# EAGLE design 8bitPig-BaconHomev2-frontPCB (EAGLE 9.2.2)
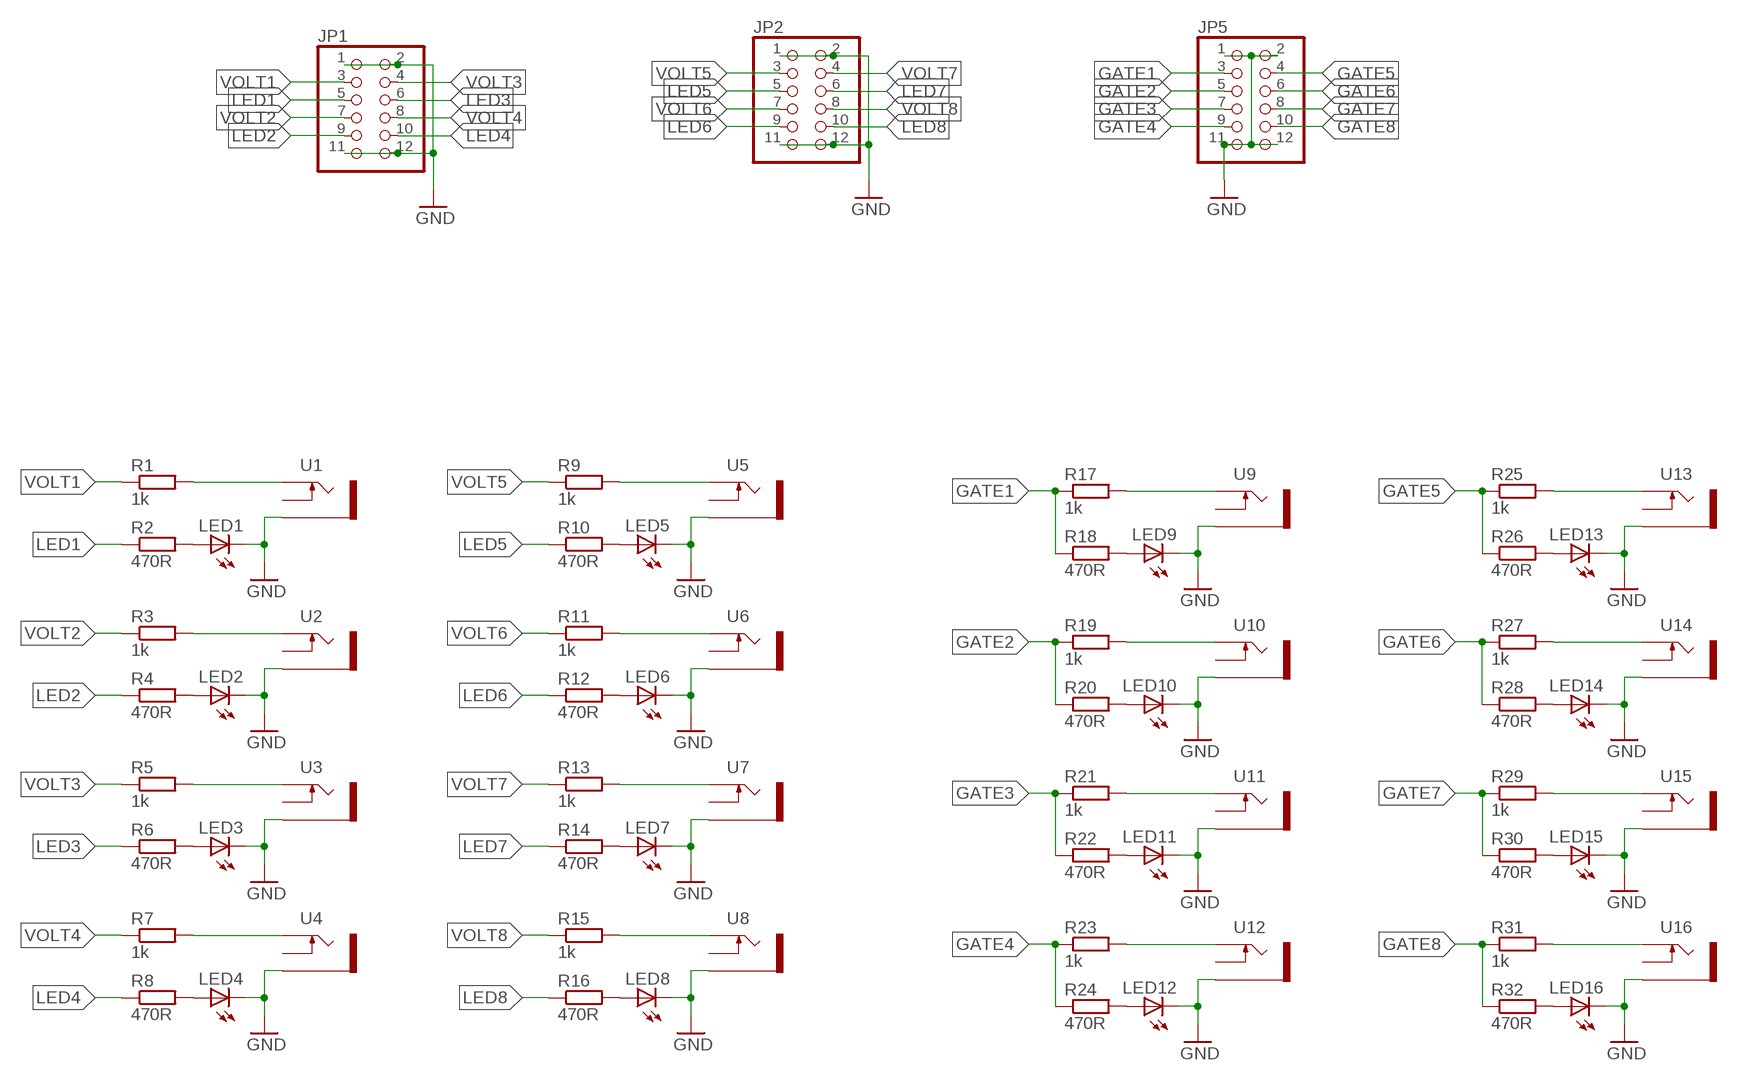
[diagram p0: schematic, sheet 1]

## Parts
JP1  PINHD-2X6  [2X06]
JP2  PINHD-2X6  [2X06]
JP5  PINHD-2X6  [2X06]
LED1  LED3MM  [LED3MM]
LED2  LED3MM  [LED3MM]
LED3  LED3MM  [LED3MM]
LED4  LED3MM  [LED3MM]
LED5  LED3MM  [LED3MM]
LED6  LED3MM  [LED3MM]
LED7  LED3MM  [LED3MM]
LED8  LED3MM  [LED3MM]
LED9  LED3MM  [LED3MM]
LED10  LED3MM  [LED3MM]
LED11  LED3MM  [LED3MM]
LED12  LED3MM  [LED3MM]
LED13  LED3MM  [LED3MM]
LED14  LED3MM  [LED3MM]
LED15  LED3MM  [LED3MM]
LED16  LED3MM  [LED3MM]
R1  1k  R-EU_R0603  [R0603]
R2  470R  R-EU_R0603  [R0603]
R3  1k  R-EU_R0603  [R0603]
R4  470R  R-EU_R0603  [R0603]
R5  1k  R-EU_R0603  [R0603]
R6  470R  R-EU_R0603  [R0603]
R7  1k  R-EU_R0603  [R0603]
R8  470R  R-EU_R0603  [R0603]
R9  1k  R-EU_R0603  [R0603]
R10  470R  R-EU_R0603  [R0603]
R11  1k  R-EU_R0603  [R0603]
R12  470R  R-EU_R0603  [R0603]
R13  1k  R-EU_R0603  [R0603]
R14  470R  R-EU_R0603  [R0603]
R15  1k  R-EU_R0603  [R0603]
R16  470R  R-EU_R0603  [R0603]
R17  1k  R-EU_R0603  [R0603]
R18  470R  R-EU_R0603  [R0603]
R19  1k  R-EU_R0603  [R0603]
R20  470R  R-EU_R0603  [R0603]
R21  1k  R-EU_R0603  [R0603]
R22  470R  R-EU_R0603  [R0603]
R23  1k  R-EU_R0603  [R0603]
R24  470R  R-EU_R0603  [R0603]
R25  1k  R-EU_R0603  [R0603]
R26  470R  R-EU_R0603  [R0603]
R27  1k  R-EU_R0603  [R0603]
R28  470R  R-EU_R0603  [R0603]
R29  1k  R-EU_R0603  [R0603]
R30  470R  R-EU_R0603  [R0603]
R31  1k  R-EU_R0603  [R0603]
R32  470R  R-EU_R0603  [R0603]
U1  THONKICONNNEW  [WQP-PJ301M-12_JACK]
U2  THONKICONNNEW  [WQP-PJ301M-12_JACK]
U3  THONKICONNNEW  [WQP-PJ301M-12_JACK]
U4  THONKICONNNEW  [WQP-PJ301M-12_JACK]
U5  THONKICONNNEW  [WQP-PJ301M-12_JACK]
U6  THONKICONNNEW  [WQP-PJ301M-12_JACK]
U7  THONKICONNNEW  [WQP-PJ301M-12_JACK]
U8  THONKICONNNEW  [WQP-PJ301M-12_JACK]
U9  THONKICONNNEW  [WQP-PJ301M-12_JACK]
U10  THONKICONNNEW  [WQP-PJ301M-12_JACK]
U11  THONKICONNNEW  [WQP-PJ301M-12_JACK]
U12  THONKICONNNEW  [WQP-PJ301M-12_JACK]
U13  THONKICONNNEW  [WQP-PJ301M-12_JACK]
U14  THONKICONNNEW  [WQP-PJ301M-12_JACK]
U15  THONKICONNNEW  [WQP-PJ301M-12_JACK]
U16  THONKICONNNEW  [WQP-PJ301M-12_JACK]

## Nets
GATE1: JP5.3 R17.1 R18.1
GATE2: JP5.5 R19.1 R20.1
GATE3: JP5.7 R21.1 R22.1
GATE4: JP5.9 R23.1 R24.1
GATE5: JP5.4 R25.1 R26.1
GATE6: JP5.6 R27.1 R28.1
GATE7: JP5.8 R29.1 R30.1
GATE8: JP5.10 R31.1 R32.1
GND [pwr]: JP1.1 JP1.2 JP1.11 JP1.12 JP2.1 JP2.2 JP2.11 JP2.12 JP5.1 JP5.2 JP5.11 JP5.12 LED1.K(C) LED2.K(C) LED3.K(C) LED4.K(C) LED5.K(C) LED6.K(C) LED7.K(C) LED8.K(C) LED9.K(C) LED10.K(C) LED11.K(C) LED12.K(C) LED13.K(C) LED14.K(C) LED15.K(C) LED16.K(C) U1.P$3_SLEEVE(SLEEVE) U2.P$3_SLEEVE(SLEEVE) U3.P$3_SLEEVE(SLEEVE) U4.P$3_SLEEVE(SLEEVE) U5.P$3_SLEEVE(SLEEVE) U6.P$3_SLEEVE(SLEEVE) U7.P$3_SLEEVE(SLEEVE) U8.P$3_SLEEVE(SLEEVE) U9.P$3_SLEEVE(SLEEVE) U10.P$3_SLEEVE(SLEEVE) U11.P$3_SLEEVE(SLEEVE) U12.P$3_SLEEVE(SLEEVE) U13.P$3_SLEEVE(SLEEVE) U14.P$3_SLEEVE(SLEEVE) U15.P$3_SLEEVE(SLEEVE) U16.P$3_SLEEVE(SLEEVE)
LED1: JP1.5 R2.1
LED2: JP1.9 R4.1
LED3: JP1.6 R6.1
LED4: JP1.10 R8.1
LED5: JP2.5 R10.1
LED6: JP2.9 R12.1
LED7: JP2.6 R14.1
LED8: JP2.10 R16.1
N$1: LED1.A R2.2
N$2: R1.2 U1.P$1_TIP(TIP)
N$3: LED2.A R4.2
N$4: R3.2 U2.P$1_TIP(TIP)
N$5: LED3.A R6.2
N$6: R5.2 U3.P$1_TIP(TIP)
N$7: LED4.A R8.2
N$8: R7.2 U4.P$1_TIP(TIP)
N$9: LED5.A R10.2
N$10: R9.2 U5.P$1_TIP(TIP)
N$11: LED6.A R12.2
N$12: R11.2 U6.P$1_TIP(TIP)
N$13: LED7.A R14.2
N$14: R13.2 U7.P$1_TIP(TIP)
N$15: LED8.A R16.2
N$16: R15.2 U8.P$1_TIP(TIP)
N$17: LED9.A R18.2
N$18: R17.2 U9.P$1_TIP(TIP)
N$19: LED10.A R20.2
N$20: R19.2 U10.P$1_TIP(TIP)
N$21: LED11.A R22.2
N$22: R21.2 U11.P$1_TIP(TIP)
N$23: LED12.A R24.2
N$24: R23.2 U12.P$1_TIP(TIP)
N$25: LED13.A R26.2
N$26: R25.2 U13.P$1_TIP(TIP)
N$27: LED14.A R28.2
N$28: R27.2 U14.P$1_TIP(TIP)
N$29: LED15.A R30.2
N$30: R29.2 U15.P$1_TIP(TIP)
N$33: LED16.A R32.2
N$34: R31.2 U16.P$1_TIP(TIP)
VOLT1: JP1.3 R1.1
VOLT2: JP1.7 R3.1
VOLT3: JP1.4 R5.1
VOLT4: JP1.8 R7.1
VOLT5: JP2.3 R9.1
VOLT6: JP2.7 R11.1
VOLT7: JP2.4 R13.1
VOLT8: JP2.8 R15.1
Unconnected: U1.P$2_SWITCH(SWITCH) U2.P$2_SWITCH(SWITCH) U3.P$2_SWITCH(SWITCH) U4.P$2_SWITCH(SWITCH) U5.P$2_SWITCH(SWITCH) U6.P$2_SWITCH(SWITCH) U7.P$2_SWITCH(SWITCH) U8.P$2_SWITCH(SWITCH) U9.P$2_SWITCH(SWITCH) U10.P$2_SWITCH(SWITCH) U11.P$2_SWITCH(SWITCH) U12.P$2_SWITCH(SWITCH) U13.P$2_SWITCH(SWITCH) U14.P$2_SWITCH(SWITCH) U15.P$2_SWITCH(SWITCH) U16.P$2_SWITCH(SWITCH)

## Library data of the parts
JP1 JP2 JP5 = pinhead:PINHD-2X6: PIN HEADER
LED1-LED16 = led:LED: LED OSRAM: - CHIPLED LG R971, LG N971, LY N971, LG Q971, LY Q971, LO R971, LY R971 LH N974, LH R974 LS Q976, LO Q976, LY Q976 LO Q996 - Hyper CHIPLED LW Q18S LB Q993, LB Q99A, LB R99A - SideLED LS A670, LO A670, LY A670, LG A670, LP A670 LB A673, LV A673, LT A673, LW A673 LH A674 LY A675 LS A676, LA A676, LO A676, LY A676, LW A676 LS A679, LY A679, LG A679 - Hyper Micro SIDELED® LS Y876, LA Y876, LO Y876, LY Y876 LT Y87S - SmartLED LW L88C, LW L88S LB L89C, LB L89S, LG L890 LS L89K, LO L89K, LY L89K LS L896, LA L896, LO L896, LY L896 - TOPLED LS T670, LO T670, LY T670, LG T670, LP T670 LSG T670, LSP T670, LSY T670, LOP T670, LYG T670 LG T671, LOG T671, LSG T671 LB T673, LV T673, LT T673, LW T673 LH T674 LS T676, LA T676, LO T676, LY T676, LB T676, LH T676, LSB T676, LW T676 LB T67C, LV T67C, LT T67C, LS T67K, LO T67K, LY T67K, LW E67C LS E67B, LA E67B, LO E67B, LY E67B, LB E67C, LV E67C, LT E67C LW T67C LS T679, LY T679, LG T679 LS T770, LO T770, LY T770, LG T770, LP T770 LB T773, LV T773, LT T773, LW T773 LH T774 LS E675, LA E675, LY E675, LS T675 LS T776, LA T776, LO T776, LY T776, LB T776 LHGB T686 LT T68C, LB T68C - Hyper Mini TOPLED® LB M676 - Mini TOPLED Santana® LG M470 LS M47K, LO M47K, LY M47K Source: http://www.osram.convergy.de LUXEON: - LUMILED® LXK2-PW12-R00, LXK2-PW12-S00, LXK2-PW14-U00, LXK2-PW14-V00 LXK2-PM12-R00, LXK2-PM12-S00, LXK2-PM14-U00 LXK2-PE12-Q00, LXK2-PE12-R00, LXK2-PE12-S00, LXK2-PE14-T00, LXK2-PE14-U00 LXK2-PB12-K00, LXK2-PB12-L00, LXK2-PB12-M00, LXK2-PB14-N00, LXK2-PB14-P00, LXK2-PB14-Q00 LXK2-PR12-L00, LXK2-PR12-M00, LXK2-PR14-Q00, LXK2-PR14-R00 LXK2-PD12-Q00, LXK2-PD12-R00, LXK2-PD12-S00 LXK2-PH12-R00, LXK2-PH12-S00 LXK2-PL12-P00, LXK2-PL12-Q00, LXK2-PL12-R00 Source: www.luxeon.com KINGBRIGHT: KA-3528ASYC Source: www.kingbright.com
R1-R32 = resistor:R-EU_: RESISTOR, European symbol
U1-U16 = MusicThingModular:THONKICONN: 3.5mm socket for Eurorack modular synths

## Net classes
0 default: width 0.152 mm, clearance 0.508 mm
1 pwr: width 0.254 mm, clearance 0.508 mm
2 spi: width 0.152 mm, clearance 0.508 mm

## Board
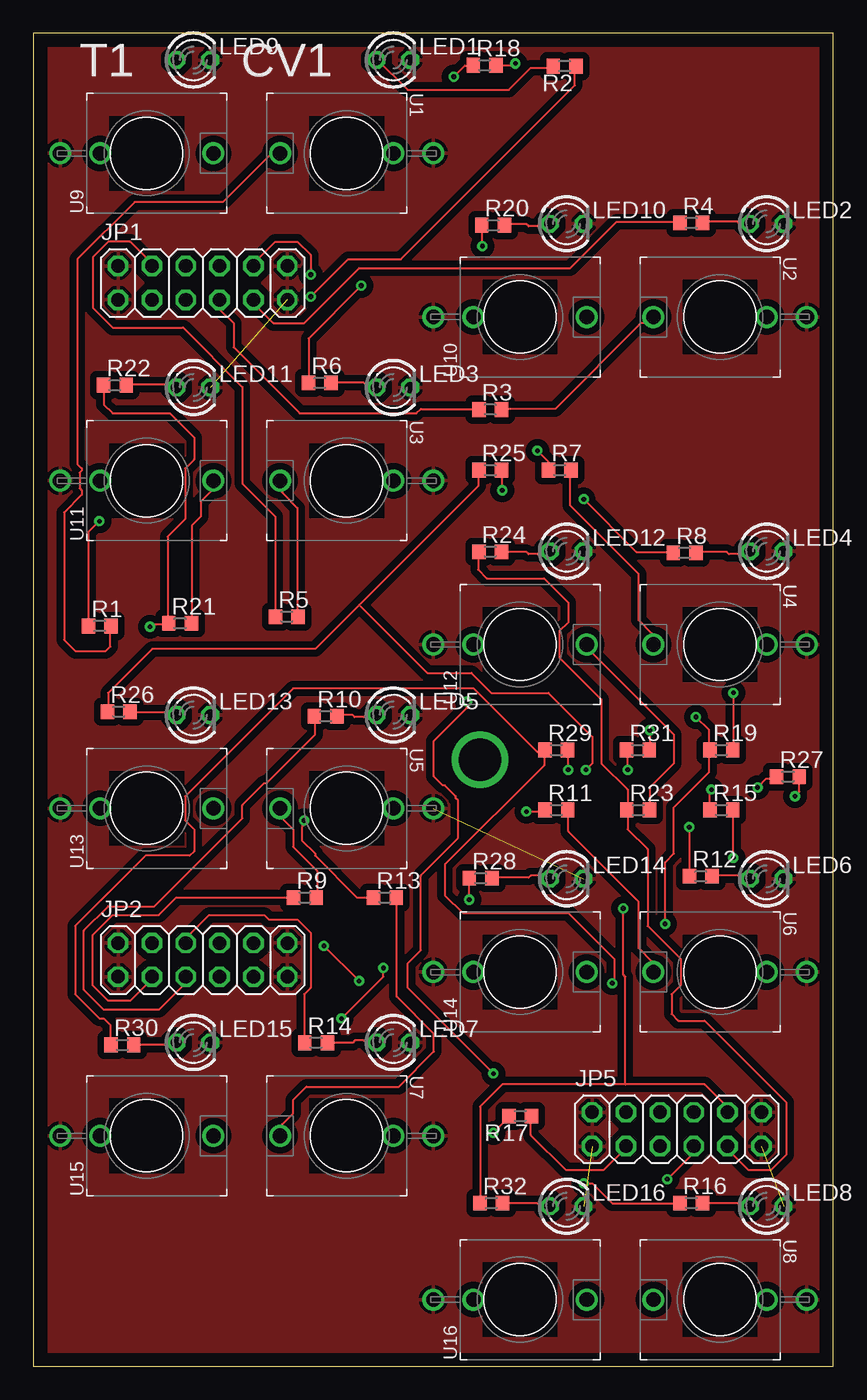
[diagram p1: board, top side]
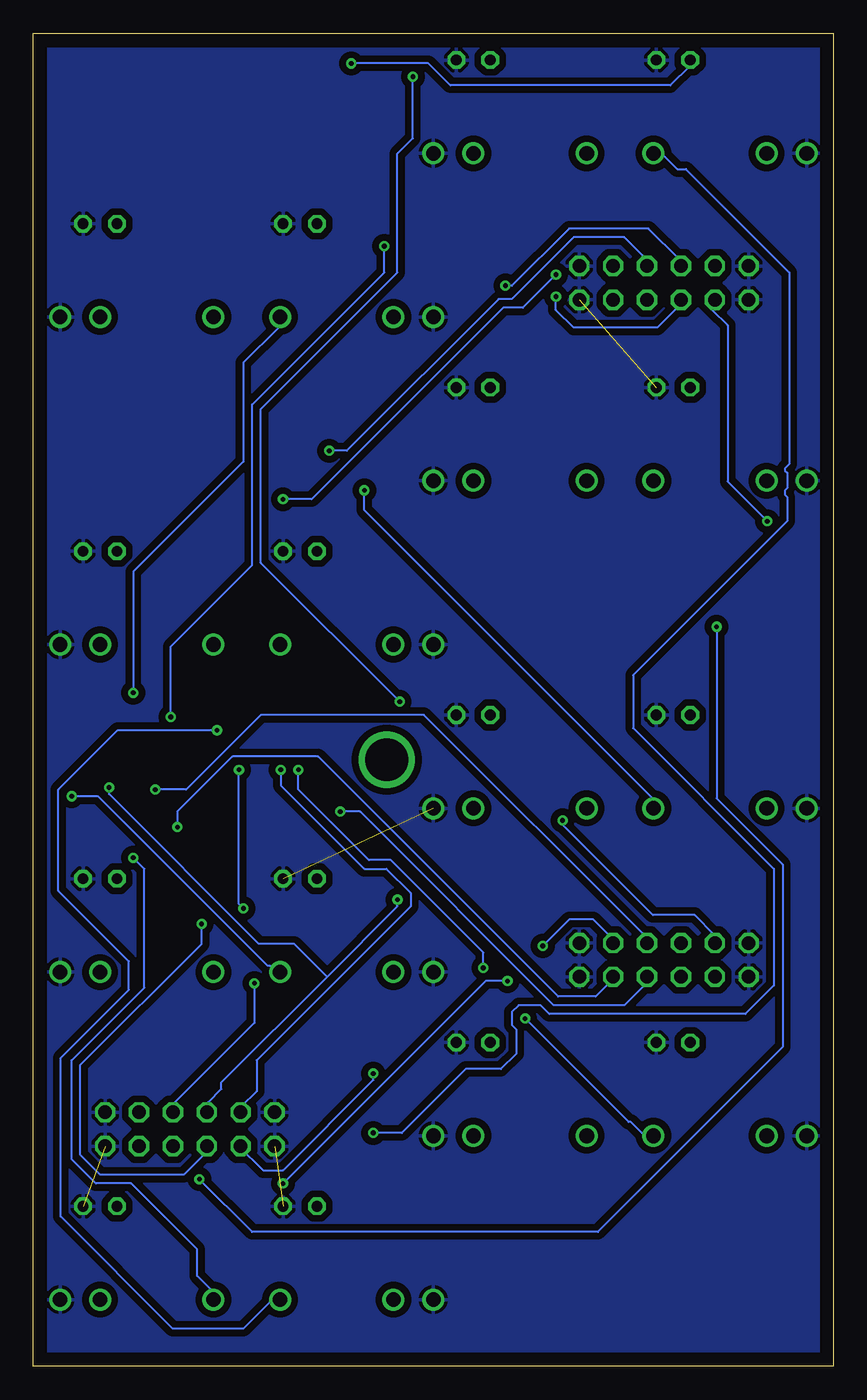
[diagram p2: board, bottom side, seen from below]

Size 60 x 100 mm. Coordinates in mm from the lower left corner, seen from the top.
Outline: 0,0 60,0 60,100 0,100 0,0
Copper layers (1*16): Top 0.035mm / dielectric 1.5mm / Bottom 0.035mm
Design rules "default": minimum track width 6mil, minimum drill 0.35mm, track to track 6mil, track to pad 6mil, pad to pad 6mil, via to via 6mil, smd to smd 6mil, copper to edge 40mil, drill to drill 6mil, minimum pad ring 10mil, minimum via ring 8mil, stop-mask expansion 4mil, vias tented up to drill 0mil, thermal gap 10mil

### Footprints (pad centres in the part's own frame; a part is rotated, then mirrored left to right if it is on the bottom)
2X06 = drill 1.016 octagon: 1 -6.35,-1.27; 2 -6.35,1.27; 3 -3.81,-1.27; 4 -3.81,1.27; 5 -1.27,-1.27; 6 -1.27,1.27; 7 1.27,-1.27; 8 1.27,1.27; 9 3.81,-1.27; 10 3.81,1.27; 11 6.35,-1.27; 12 6.35,1.27
LED3MM = drill 0.813 octagon: A -1.27,0; K 1.27,0
R0603 = smd 1 x 1.1: 1 -0.85,0; 2 0.85,0
WQP-PJ301M-12_JACK = drill 1.1: P$1_TIP 0,5; P$2_SWITCH 0,-3.5; P$3_SLEEVE 0,-6.5

### Placement (x,y rotation side)
JP1  12.7,81.28 0 top
JP2  12.7,30.48 0 top
JP5  48.26,17.78 0 top
LED1  27,98 0 top
LED2  55,85.71 0 top
LED3  27,73.43 0 top
LED4  55,61.14 0 top
LED5  27,48.86 0 top
LED6  55,36.57 0 top
LED7  27,24.29 0 top
LED8  55,12 0 top
LED9  12,98 0 top
LED10  40,85.71 0 top
LED11  12,73.43 0 top
LED12  40,61.14 0 top
LED13  12,48.86 0 top
LED14  40,36.57 0 top
LED15  12,24.29 0 top
LED16  40,12 0 top
R1  4.99,55.53 0 top
R2  39.85,97.53 180 top
R3  34.26,71.77 0 top
R4  49.35,85.77 0 top
R5  19,56.23 0 top
R6  21.49,73.77 0 top
R7  39.49,67.23 0 top
R8  48.85,61.02 0 top
R9  20.36,35.15 0 top
R10  21.92,48.76 0 top
R11  39.23,41.73 0 top
R12  50.06,36.76 0 top
R13  26.36,35.15 0 top
R14  21.2,24.26 0 top
R15  51.61,41.73 0 top
R16  49.35,12.24 0 top
R17  36.51,18.77 180 top
R18  33.85,97.6 0 top
R19  51.61,46.23 0 top
R20  34.49,85.6 0 top
R21  11,55.73 0 top
R22  6.12,73.6 0 top
R23  45.35,41.73 0 top
R24  34.26,61.1 0 top
R25  34.26,67.23 0 top
R26  6.4,49.1 0 top
R27  56.6,44.23 0 top
R28  33.54,36.6 0 top
R29  39.22,46.23 0 top
R30  6.68,24.1 0 top
R31  45.35,46.23 0 top
R32  34.35,12.23 0 top
U1  23.5,91 90 top
U2  51.5,78.71 90 top
U3  23.5,66.43 90 top
U4  51.5,54.14 90 top
U5  23.5,41.86 90 top
U6  51.5,29.57 90 top
U7  23.5,17.29 90 top
U8  51.5,5 90 top
U9  8.5,91 270 top
U10  36.5,78.71 270 top
U11  8.5,66.43 270 top
U12  36.5,54.14 270 top
U13  8.5,41.86 270 top
U14  36.5,29.57 270 top
U15  8.5,17.29 270 top
U16  36.5,5 270 top

### Tracks (layer width: path | path; a pad name or v marks a point on that pad's centre or on a via)
GATE1  (via drill 0.35)
  Top 0.152: R17.1 37.31,18.66 37.31,17.34 39.95,14.69 42.76,14.69 44.58,16.51 JP5.3 | v31.53,96.75 32.36,97.57 32.85,97.57 R18.1 | v32.52,49.86 32.52,49.37 30.05,46.89 30.05,44.25 30.71,43.59 30.87,43.59 31.7,42.76 31.7,42.6 31.86,42.43 31.86,39.62 29.06,36.82 29.06,31.2 28.07,30.21 28.07,28.4 v34.51,21.96
  Bottom 0.152: v31.53,96.75 31.53,92.13 32.69,90.97 32.69,82.06 42.93,71.82 42.93,60.26 v32.52,49.86 | v34.51,21.96 34.51,21.46 41.27,14.69 42.76,14.69 44.58,16.51 JP5.3
GATE2  (via drill 0.35)
  Top 0.152: v47.38,33.19 47.38,37.81 48.04,38.47 48.04,41.94 50.69,44.58 50.69,46.06 R19.1 50.69,46.23 50.69,47.71 v49.7,48.7 | v33.68,84.04 33.68,85.52 R20.1
  Bottom 0.152: v47.38,33.19 47.38,31.7 56.46,22.62 56.46,15.85 54.98,14.36 48.7,14.36 47.05,16.02 47.05,16.51 JP5.5 | v33.68,84.04 33.68,82.06 43.59,72.15 43.59,60.1 49.7,53.99 v49.7,48.7
GATE3  (via drill 0.35)
  Top 0.152: R22.1 5.28,73.47 5.28,72.15 5.94,71.49 10.24,71.49 12.05,69.67 12.05,68.02 11.39,67.36 11.39,63.56 10.07,62.24 10.07,55.8 R21.1 10.07,55.64 8.91,55.64 v8.75,55.47 | JP5.7 49.53,16.02 v47.55,14.03
  Bottom 0.152: v47.55,14.03 43.59,10.07 17.67,10.07 3.8,23.94 3.8,37.64 8.75,42.6 v8.75,55.47
GATE4
  Top 0.152: R24.1 33.35,61.09 33.35,59.77 34.01,59.11 38.3,59.11 40.12,57.29 40.12,55.8 39.46,55.14 39.46,53.16 42.6,50.02 42.6,45.24 44.58,43.26 44.58,41.77 R23.1 44.58,41.6 44.58,40.28 46.06,38.8 46.06,33.02 48.54,30.54 48.54,28.56 47.88,27.9 47.88,26.42 48.37,25.92 50.35,25.92 56.46,19.81 56.46,15.85 55.31,14.69 53.66,14.69 52.17,16.18 52.17,16.51 JP5.9
GATE5  (via drill 0.35)
  Top 0.152: 24.43,57.12 33.35,66.04 33.35,67.2 R25.1 | 24.43,57.12 21.13,53.82 8.91,53.82 5.61,50.52 5.61,49.2 R26.1 | v41.44,44.74 41.94,45.24 41.94,47.22 38.63,50.52 34.34,50.52 32.85,52.01 29.55,52.01 24.43,57.12
  Bottom 0.152: v41.44,44.74 41.44,43.59 35.17,37.31 33.52,37.31 31.7,35.5 31.7,34.51 43.26,22.95 43.26,20.64 44.41,19.48 44.41,19.15 JP5.4
GATE6  (via drill 0.35)
  Top 0.152: v32.69,35 32.69,36.49 R28.1 | v54.32,43.42 54.98,44.08 55.64,44.08 R27.1
  Bottom 0.152: v32.69,35 32.69,34.51 37.97,29.22 | 37.97,29.22 45.9,21.3 45.9,20.8 46.89,19.81 46.89,19.15 JP5.6 | v54.32,43.42 54.32,42.93 43.09,31.7 40.45,31.7 37.97,29.22
GATE7  (via drill 0.35)
  Top 0.152: 38.3,46.06 37.81,46.06 33.02,50.85 19.48,50.85 11.39,42.76 11.39,40.95 12.05,40.28 12.05,38.63 11.72,38.3 8.42,38.3 3.14,33.02 3.14,27.9 4.95,26.09 5.28,26.09 5.78,25.59 5.78,24.11 R30.1 | v43.42,28.73 43.59,28.89 43.59,30.54 40.12,34.01 32.19,34.01 30.87,35.33 30.87,37.64 38.3,45.07 38.3,46.06 | 38.3,46.06 R29.1
  Bottom 0.152: JP5.8 49.53,19.65 43.42,25.76 v43.42,28.73
GATE8  (via drill 0.35)
  Top 0.152: 44.41,21.13 50.35,21.13 52.01,19.48 52.01,19.15 JP5.10 | 44.41,21.13 35.17,21.13 33.52,19.48 33.52,12.38 R32.1 | v44.58,44.74 44.58,46.06 R31.1 | v44.25,34.34 44.25,29.39 44.41,29.22 44.41,21.13
  Bottom 0.152: v44.58,44.74 44.58,34.67 v44.25,34.34
GND  (4 unrouted)
  pour Top: 1,99 58.5,99 59,99 59,1 1,1
  pour Bottom: 1,99 59,99 59,1 1,1
LED1  (via drill 0.35)
  Top 0.152: v20.8,80.24 23.61,83.05 27.57,83.05 40.62,96.09 40.62,97.41 R2.1
  Bottom 0.152: v20.8,80.24 20.8,79.25 19.48,77.93 13.21,77.93 11.56,79.58 11.56,79.91 JP1.5
LED2
  Top 0.152: JP1.9 16.51,79.74 18,78.26 20.31,78.26 24.43,82.39 40.28,82.39 43.75,85.85 48.37,85.85 R4.1
LED3  (via drill 0.35)
  Top 0.152: v24.6,81.06 20.64,77.1 20.64,73.8 R6.1
  Bottom 0.152: v24.6,81.06 24.11,81.06 19.81,85.36 13.87,85.36 11.56,83.05 11.56,82.55 JP1.6
LED4  (via drill 0.35)
  Top 0.152: v41.27,65.05 45.24,61.09 47.88,61.09 R8.1 | v20.8,81.89 20.8,83.38 19.81,84.37 18.16,84.37 16.51,82.72 JP1.10
  Bottom 0.152: v41.27,65.05 39.13,65.05 24.77,79.41 23.28,79.41 v20.8,81.89
LED5
  Top 0.152: R10.1 21.13,48.7 21.13,47.38 17.5,43.75 17.34,43.75 15.68,42.1 15.68,41.11 9.08,34.51 5.61,34.51 3.8,32.69 3.8,28.23 5.28,26.75 9.41,26.75 11.39,28.73 11.39,29.06 JP2.5
LED6  (via drill 0.35)
  Top 0.152: v49.2,40.45 49.2,36.82 R12.1
  Bottom 0.152: v49.2,40.45 49.2,41.6 45.07,45.73 38.63,45.73 20.64,27.74 17.83,27.74 16.51,29.06 JP2.9
LED7
  Top 0.152: R14.1 20.31,24.27 20.31,27.9 20.8,28.4 20.8,32.52 19.81,33.52 17.67,33.52 17.34,33.85 13.21,33.85 11.56,32.19 11.56,31.86 JP2.6
LED8  (via drill 0.35)
  Top 0.152: v41.27,13.7 41.94,13.7 43.42,12.22 48.37,12.22 R16.1 | v21.79,31.53 v24.43,28.89
  Bottom 0.152: v41.27,13.7 26.09,28.89 v24.43,28.89 | v21.79,31.53 19.81,33.52 18,33.52 16.51,32.03 JP2.10
N0$31  (via drill 3.2)
  other vias: 33.5,45.5
N$1
  Top 0.152: R2.2 38.96,97.41 37.31,97.41 35.66,95.76 28.07,95.76 25.76,98.07 LED1.A
N$2
  Top 0.152: R1.2 5.78,55.47 5.78,53.99 5.45,53.66 3.14,53.66 2.31,54.48 2.31,64.06 3.63,65.38 3.63,65.71 3.47,65.88 3.47,67.03 3.63,67.2 3.63,67.36 3.3,67.69 3.3,83.05 7.59,87.34 14.2,87.34 17.83,90.97 18.49,90.97 U1.P$1_TIP
N$3
  Top 0.152: R4.2 50.35,85.85 52.83,85.85 53,85.69 53.66,85.69 LED2.A
N$4
  Top 0.152: R3.2 35.17,71.82 39.13,71.82 45.57,78.26 45.73,78.26 46.06,78.59 46.39,78.59 U2.P$1_TIP
N$5
  Top 0.152: R6.2 22.45,73.8 24.77,73.8 25.09,73.47 25.59,73.47 LED3.A
N$6
  Top 0.152: R5.2 19.81,56.3 19.81,64.39 18.66,65.55 18.66,66.37 U3.P$1_TIP
N$7
  Top 0.152: R8.2 49.86,61.09 52.01,61.09 52.17,60.92 52.83,60.92 53,61.09 53.66,61.09 LED4.A
N$8
  Top 0.152: R7.2 40.28,67.2 40.28,64.55 45.4,59.44 45.4,55.97 46.39,54.98 46.39,54.15 U4.P$1_TIP
N$9
  Top 0.152: R10.2 22.78,48.87 23.94,48.87 24.11,48.7 24.77,48.7 25.09,49.03 25.43,49.03 25.59,48.87 LED5.A
N$10
  Top 0.152: R9.2 21.3,35.17 21.3,37.15 19.48,38.96 19.48,40.28 18.66,41.11 18.66,41.77 U5.P$1_TIP
N$11
  Top 0.152: R12.2 51.02,36.82 52.83,36.82 53,36.65 53.66,36.65 LED6.A
N$12
  Top 0.152: R11.2 40.12,41.6 40.12,40.12 45.4,34.84 45.4,31.37 46.39,30.38 46.39,29.72 U6.P$1_TIP
N$13
  Top 0.152: R14.2 22.12,24.27 23.94,24.27 24.11,24.43 24.77,24.43 25.09,24.11 25.43,24.11 25.59,24.27 LED7.A
N$14
  Top 0.152: R13.2 27.24,35 27.24,27.74 30.05,24.93 30.05,23.61 27.41,20.97 20.47,20.97 19.48,19.98 19.48,18.99 18.66,18.16 18.66,17.34 U7.P$1_TIP
N$15
  Top 0.152: R16.2 50.35,12.22 52.83,12.22 53,12.05 53.66,12.05 LED8.A
N$16  (via drill 0.35)
  Top 0.152: v52.5,38.14 52.5,41.6 R15.2
  Bottom 0.152: v52.5,38.14 51.68,37.31 51.68,28.4 57.12,22.95 57.12,15.52 55.31,13.7 52.67,13.7 47.71,8.75 47.71,6.77 46.56,5.61 46.56,5.12 U8.P$1_TIP
N$17  (via drill 0.35)
  Top 0.152: v36.16,97.74 35.99,97.57 34.84,97.57 R18.2
  Bottom 0.152: v36.16,97.74 30.38,97.74 28.73,96.09 12.22,96.09 10.73,97.57 10.73,97.9 LED9.A
N$18  (via drill 0.35)
  Top 0.152: v34.51,17.5 35.66,18.66 R17.2
  Bottom 0.152: v34.51,17.5 32.36,17.5 27.57,22.29 24.93,22.29 23.77,23.44 23.77,25.26 24.11,25.59 24.11,26.58 23.61,27.08 21.96,27.08 21.3,26.42 6.6,26.42 4.46,28.56 4.46,37.31 15.02,47.88 15.02,51.84 3.47,63.4 3.47,65.22 3.63,65.38 3.63,65.71 3.47,65.88 3.47,67.03 3.63,67.2 3.63,67.36 3.3,67.69 3.3,82.06 11.06,89.81 11.72,89.81 12.88,90.97 13.37,90.97 U9.P$1_TIP
N$19
  Top 0.152: R20.2 35.5,85.69 36.98,85.69 37.15,85.52 37.81,85.52 38.14,85.85 38.63,85.85 LED10.A
N$20  (via drill 0.35)
  Top 0.152: v52.5,50.52 52.5,46.23 R19.2
  Bottom 0.152: v52.5,50.52 52.5,59.6 44.25,67.86 44.25,75.29 41.6,77.93 41.6,78.59 U10.P$1_TIP
N$21
  Top 0.152: R22.2 7.1,73.64 9.91,73.64 10.07,73.47 10.57,73.47 LED11.A
N$22
  Top 0.152: R21.2 11.89,55.8 11.89,63.07 12.55,63.73 12.55,64.88 13.37,65.71 13.37,66.37 U11.P$1_TIP
N$23
  Top 0.152: R24.2 35.17,61.09 36.98,61.09 37.15,60.92 37.81,60.92 38.14,61.25 38.63,61.25 LED12.A
N$24
  Top 0.152: R23.2 46.23,41.77 46.23,43.42 48.04,45.24 48.04,47.38 41.44,53.99 U12.P$1_TIP
N$25
  Top 0.152: R26.2 7.26,49.03 9.91,49.03 10.07,48.87 10.57,48.87 LED13.A
N$26  (via drill 0.35)
  Top 0.152: v35.17,65.71 35.17,67.2 R25.2
  Bottom 0.152: v35.17,65.71 35.17,64.22 13.54,42.6 13.54,41.94 U13.P$1_TIP
N$27
  Top 0.152: R28.2 34.51,36.65 37.15,36.65 37.31,36.82 37.97,36.82 38.14,36.65 38.63,36.65 LED14.A
N$28  (via drill 0.35)
  Top 0.152: v57.12,42.76 57.45,43.09 57.45,44.08 R27.2
  Bottom 0.152: v57.12,42.76 55.14,42.76 42.43,30.05 42.27,30.05 41.94,29.72 41.6,29.72 U14.P$1_TIP
N$29
  Top 0.152: R30.2 7.59,24.11 9.91,24.11 10.07,24.27 10.57,24.27 LED15.A
N$30  (via drill 0.35)
  Top 0.152: v40.12,44.74 40.12,46.06 R29.2 | v26.25,29.88 26.25,29.22 v23.11,26.09
  Bottom 0.152: v40.12,44.74 40.12,43.26 34.84,37.97 33.19,37.97 26.25,31.04 v26.25,29.88 | v23.11,26.09 15.35,18.33 15.19,18.33 14.2,17.34 13.54,17.34 U15.P$1_TIP
N$33
  Top 0.152: R32.2 35.33,12.22 37.81,12.22 38.14,11.89 38.63,11.89 LED16.A
N$34  (via drill 0.35)
  Top 0.152: v46.23,47.71 46.23,46.23 R31.2
  Bottom 0.152: v46.23,47.71 53.66,47.71 58.12,43.26 58.12,35.66 52.83,30.38 52.83,28.23 57.95,23.11 57.95,11.23 49.53,2.81 44.25,2.81 42.1,4.95 41.6,4.95 U16.P$1_TIP
VOLT1  (via drill 0.35)
  Top 0.152: v4.95,63.4 4.13,62.57 4.13,55.64 R1.1
  Bottom 0.152: v4.95,63.4 7.92,66.37 7.92,78.09 9.08,79.25 9.08,79.74 8.91,79.91 JP1.3
VOLT2
  Top 0.152: R3.1 33.35,71.82 29.06,71.82 28.73,71.49 19.98,71.49 15.02,76.44 15.02,78.26 14.03,79.25 14.03,79.91 JP1.7
VOLT3
  Top 0.152: R5.1 18.16,56.3 18.16,63.73 15.68,66.2 15.68,73.47 11.23,77.93 5.94,77.93 4.46,79.41 4.46,83.21 5.61,84.37 7.26,84.37 8.75,82.88 8.75,82.55 JP1.4
VOLT4  (via drill 0.35)
  Top 0.152: v37.81,68.68 38.63,67.86 38.63,67.36 R7.1
  Bottom 0.152: v37.81,68.68 36.49,68.68 25.09,80.07 24.11,80.07 19.48,84.7 15.68,84.7 14.03,83.05 14.03,82.55 JP1.8
VOLT5
  Top 0.152: R9.1 19.48,35.17 10.73,35.17 9.41,33.85 5.94,33.85 4.46,32.36 4.46,28.56 5.61,27.41 7.26,27.41 8.91,29.06 JP2.3
VOLT6  (via drill 0.35)
  Top 0.152: v36.98,41.6 38.3,41.6 R11.1
  Bottom 0.152: v36.98,41.6 35.5,41.6 20.97,27.08 15.68,27.08 14.03,28.73 14.03,29.06 JP2.7
VOLT7  (via drill 0.35)
  Top 0.152: v20.31,40.95 20.31,40.62 20.14,40.45 20.14,39.46 21.13,38.47 21.13,38.3 24.27,35.17 25.43,35.17 R13.1
  Bottom 0.152: v20.31,40.95 20.31,40.62 13.54,33.85 10.4,33.85 8.91,32.36 8.91,31.86 JP2.4
VOLT8  (via drill 0.35)
  Top 0.152: v50.85,43.26 50.69,43.09 50.69,41.77 R15.1
  Bottom 0.152: v50.85,43.26 48.54,43.26 42.93,48.87 30.71,48.87 14.03,32.19 14.03,31.86 JP2.8

### Text on the board
tPlace: T1 | CV1